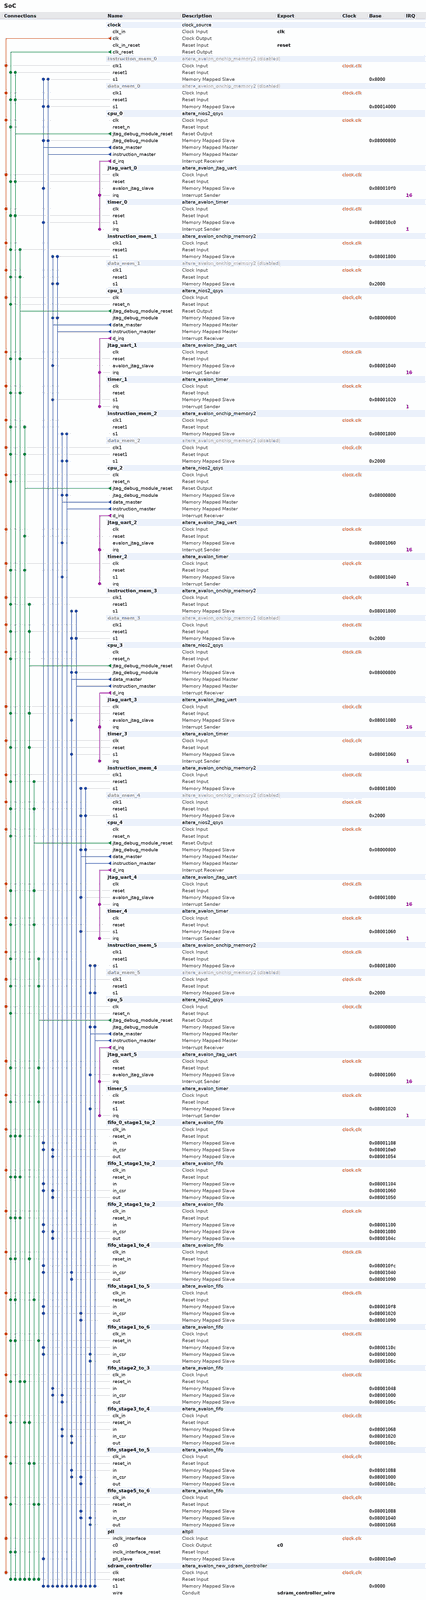
[diagram p0: system contents, whole]
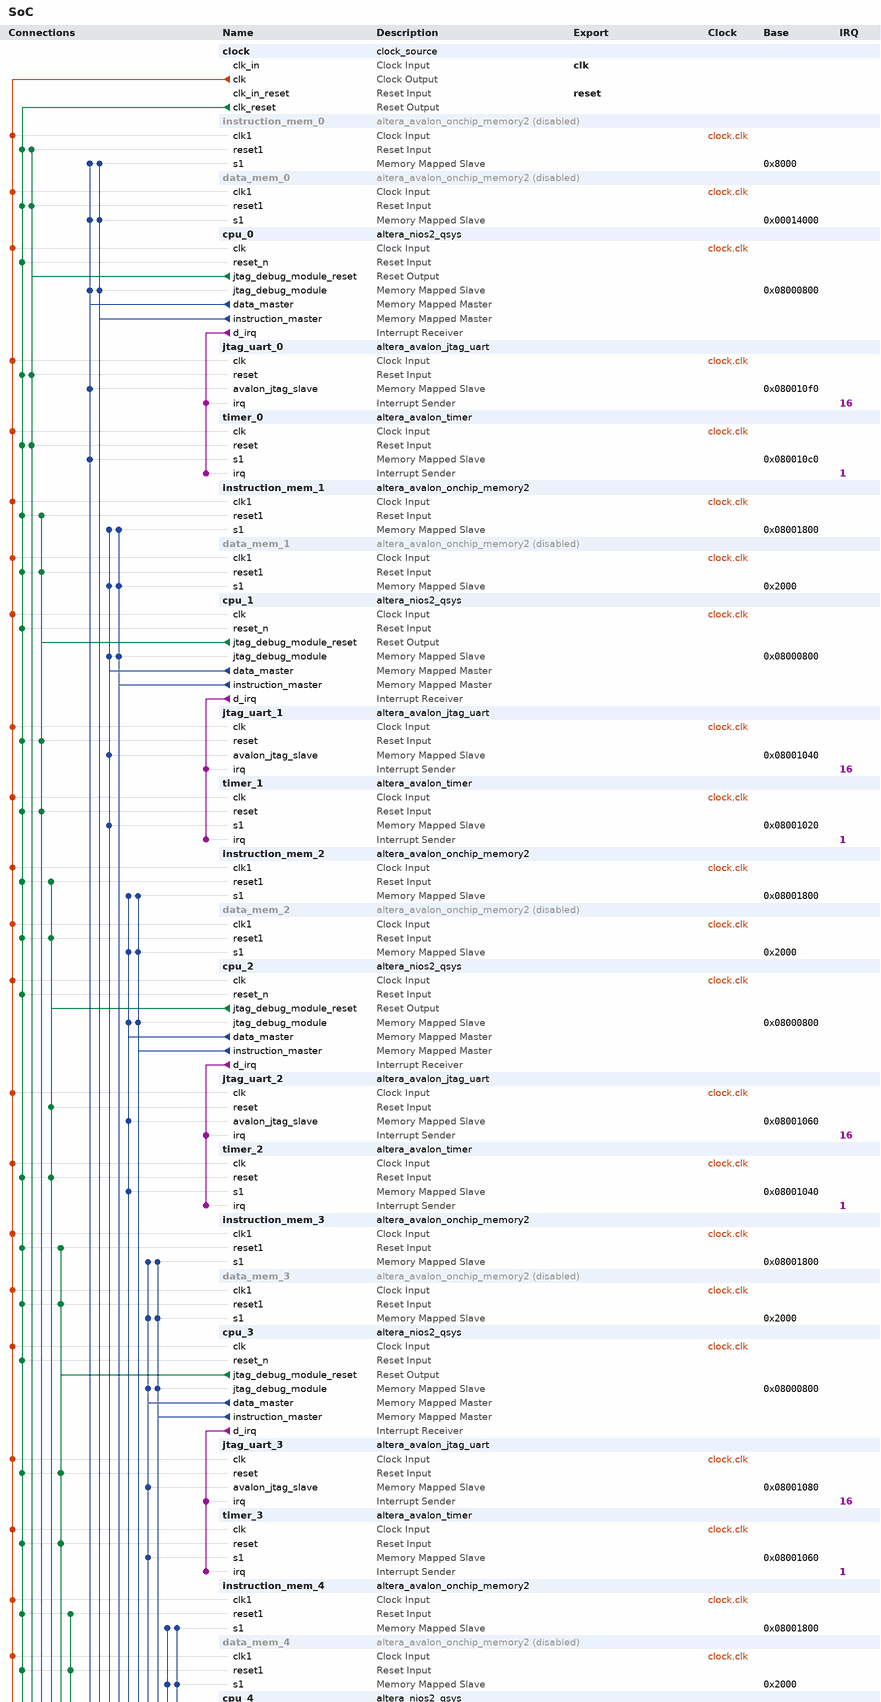
[diagram p1: system contents, upper part]
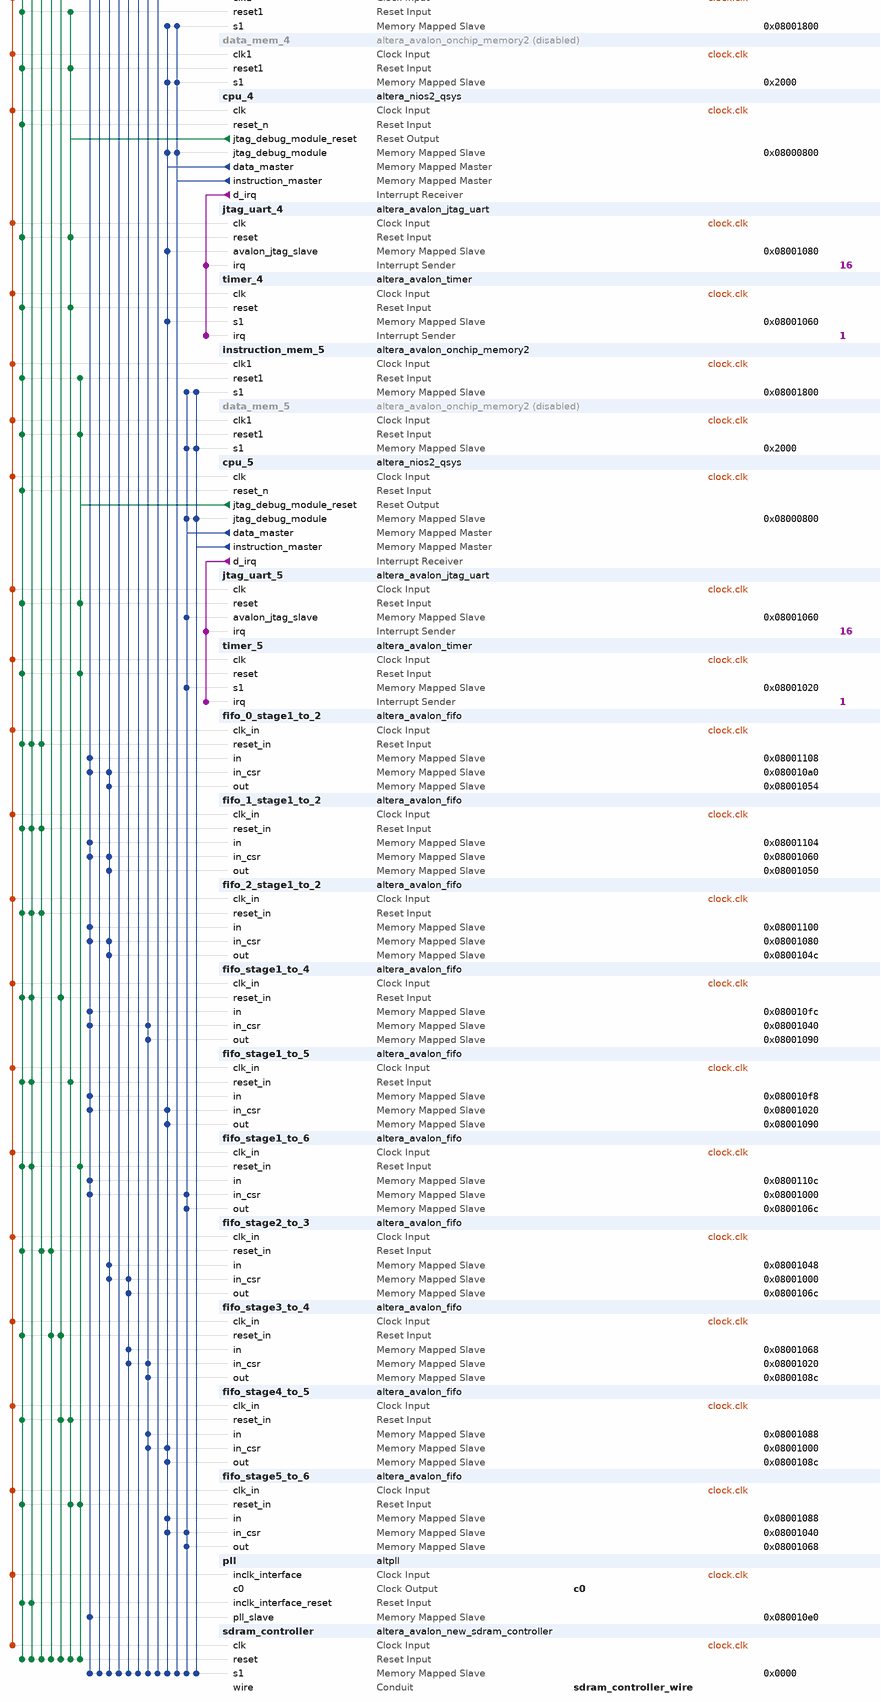
[diagram p2: system contents, lower part]
# Platform Designer (Qsys) system SoC, Cyclone IV E EP4CE115F29C7
# Parameters at their usual value, and those the tool derives, are not listed.
package require -exact qsys 12.1
create_system SoC
set_project_property DEVICE_FAMILY {Cyclone IV E}
set_project_property DEVICE EP4CE115F29C7

add_instance clock clock_source 12.1
set_instance_parameter_value clock clockFrequency 50000000

add_instance instruction_mem_0 altera_avalon_onchip_memory2 12.1
set_instance_property instruction_mem_0 ENABLED false
set_instance_parameter_value instruction_mem_0 dataWidth 32
set_instance_parameter_value instruction_mem_0 dualPort false
set_instance_parameter_value instruction_mem_0 initMemContent true
set_instance_parameter_value instruction_mem_0 initializationFileName instruction_mem_0
set_instance_parameter_value instruction_mem_0 memorySize 20480

add_instance data_mem_0 altera_avalon_onchip_memory2 12.1
set_instance_property data_mem_0 ENABLED false
set_instance_parameter_value data_mem_0 dataWidth 32
set_instance_parameter_value data_mem_0 dualPort false
set_instance_parameter_value data_mem_0 initMemContent true
set_instance_parameter_value data_mem_0 initializationFileName data_mem_0
set_instance_parameter_value data_mem_0 memorySize 12288

add_instance cpu_0 altera_nios2_qsys 12.1
set_instance_parameter_value cpu_0 resetSlave sdram_controller.s1
set_instance_parameter_value cpu_0 exceptionSlave sdram_controller.s1
set_instance_parameter_value cpu_0 breakSlave cpu_0.jtag_debug_module
set_instance_parameter_value cpu_0 impl Small
set_instance_parameter_value cpu_0 icache_size 4096

add_instance jtag_uart_0 altera_avalon_jtag_uart 12.1
set_instance_parameter_value jtag_uart_0 simInteractiveOptions INTERACTIVE_ASCII_OUTPUT

add_instance timer_0 altera_avalon_timer 12.1
set_instance_parameter_value timer_0 period 1
set_instance_parameter_value timer_0 periodUnits MSEC
set_instance_parameter_value timer_0 timerPreset CUSTOM

add_instance instruction_mem_1 altera_avalon_onchip_memory2 12.1
set_instance_parameter_value instruction_mem_1 dataWidth 32
set_instance_parameter_value instruction_mem_1 dualPort false
set_instance_parameter_value instruction_mem_1 initMemContent true
set_instance_parameter_value instruction_mem_1 initializationFileName instruction_mem_1
set_instance_parameter_value instruction_mem_1 memorySize 1024

add_instance data_mem_1 altera_avalon_onchip_memory2 12.1
set_instance_property data_mem_1 ENABLED false
set_instance_parameter_value data_mem_1 dataWidth 32
set_instance_parameter_value data_mem_1 dualPort false
set_instance_parameter_value data_mem_1 initMemContent true
set_instance_parameter_value data_mem_1 initializationFileName data_mem_1
set_instance_parameter_value data_mem_1 memorySize 8192

add_instance cpu_1 altera_nios2_qsys 12.1
set_instance_parameter_value cpu_1 resetSlave instruction_mem_1.s1
set_instance_parameter_value cpu_1 exceptionSlave instruction_mem_1.s1
set_instance_parameter_value cpu_1 breakSlave cpu_1.jtag_debug_module
set_instance_parameter_value cpu_1 impl Small
set_instance_parameter_value cpu_1 icache_size 4096

add_instance jtag_uart_1 altera_avalon_jtag_uart 12.1
set_instance_parameter_value jtag_uart_1 simInteractiveOptions INTERACTIVE_ASCII_OUTPUT

add_instance timer_1 altera_avalon_timer 12.1
set_instance_parameter_value timer_1 period 1
set_instance_parameter_value timer_1 periodUnits MSEC
set_instance_parameter_value timer_1 timerPreset CUSTOM

add_instance instruction_mem_2 altera_avalon_onchip_memory2 12.1
set_instance_parameter_value instruction_mem_2 dataWidth 32
set_instance_parameter_value instruction_mem_2 dualPort false
set_instance_parameter_value instruction_mem_2 initMemContent true
set_instance_parameter_value instruction_mem_2 initializationFileName instruction_mem_2
set_instance_parameter_value instruction_mem_2 memorySize 1024

add_instance data_mem_2 altera_avalon_onchip_memory2 12.1
set_instance_property data_mem_2 ENABLED false
set_instance_parameter_value data_mem_2 dataWidth 32
set_instance_parameter_value data_mem_2 dualPort false
set_instance_parameter_value data_mem_2 initMemContent true
set_instance_parameter_value data_mem_2 initializationFileName data_mem_2
set_instance_parameter_value data_mem_2 memorySize 4096

add_instance cpu_2 altera_nios2_qsys 12.1
set_instance_parameter_value cpu_2 resetSlave instruction_mem_2.s1
set_instance_parameter_value cpu_2 exceptionSlave instruction_mem_2.s1
set_instance_parameter_value cpu_2 breakSlave cpu_2.jtag_debug_module
set_instance_parameter_value cpu_2 impl Small
set_instance_parameter_value cpu_2 icache_size 4096

add_instance jtag_uart_2 altera_avalon_jtag_uart 12.1
set_instance_parameter_value jtag_uart_2 simInteractiveOptions INTERACTIVE_ASCII_OUTPUT

add_instance timer_2 altera_avalon_timer 12.1
set_instance_parameter_value timer_2 period 1
set_instance_parameter_value timer_2 periodUnits MSEC
set_instance_parameter_value timer_2 timerPreset CUSTOM

add_instance instruction_mem_3 altera_avalon_onchip_memory2 12.1
set_instance_parameter_value instruction_mem_3 dataWidth 32
set_instance_parameter_value instruction_mem_3 dualPort false
set_instance_parameter_value instruction_mem_3 initMemContent true
set_instance_parameter_value instruction_mem_3 initializationFileName instruction_mem_3
set_instance_parameter_value instruction_mem_3 memorySize 1024

add_instance data_mem_3 altera_avalon_onchip_memory2 12.1
set_instance_property data_mem_3 ENABLED false
set_instance_parameter_value data_mem_3 dataWidth 32
set_instance_parameter_value data_mem_3 dualPort false
set_instance_parameter_value data_mem_3 initMemContent true
set_instance_parameter_value data_mem_3 initializationFileName data_mem_3
set_instance_parameter_value data_mem_3 memorySize 4096

add_instance cpu_3 altera_nios2_qsys 12.1
set_instance_parameter_value cpu_3 resetSlave instruction_mem_3.s1
set_instance_parameter_value cpu_3 exceptionSlave instruction_mem_3.s1
set_instance_parameter_value cpu_3 breakSlave cpu_3.jtag_debug_module
set_instance_parameter_value cpu_3 impl Small
set_instance_parameter_value cpu_3 icache_size 4096

add_instance jtag_uart_3 altera_avalon_jtag_uart 12.1
set_instance_parameter_value jtag_uart_3 simInteractiveOptions INTERACTIVE_ASCII_OUTPUT

add_instance timer_3 altera_avalon_timer 12.1
set_instance_parameter_value timer_3 period 1
set_instance_parameter_value timer_3 periodUnits MSEC
set_instance_parameter_value timer_3 timerPreset CUSTOM

add_instance instruction_mem_4 altera_avalon_onchip_memory2 12.1
set_instance_parameter_value instruction_mem_4 dataWidth 32
set_instance_parameter_value instruction_mem_4 dualPort false
set_instance_parameter_value instruction_mem_4 initMemContent true
set_instance_parameter_value instruction_mem_4 initializationFileName instruction_mem_4
set_instance_parameter_value instruction_mem_4 memorySize 1024

add_instance data_mem_4 altera_avalon_onchip_memory2 12.1
set_instance_property data_mem_4 ENABLED false
set_instance_parameter_value data_mem_4 dataWidth 32
set_instance_parameter_value data_mem_4 dualPort false
set_instance_parameter_value data_mem_4 initMemContent true
set_instance_parameter_value data_mem_4 initializationFileName data_mem_4
set_instance_parameter_value data_mem_4 memorySize 4096

add_instance cpu_4 altera_nios2_qsys 12.1
set_instance_parameter_value cpu_4 resetSlave instruction_mem_4.s1
set_instance_parameter_value cpu_4 exceptionSlave instruction_mem_4.s1
set_instance_parameter_value cpu_4 breakSlave cpu_4.jtag_debug_module
set_instance_parameter_value cpu_4 impl Small
set_instance_parameter_value cpu_4 icache_size 4096

add_instance jtag_uart_4 altera_avalon_jtag_uart 12.1
set_instance_parameter_value jtag_uart_4 simInteractiveOptions INTERACTIVE_ASCII_OUTPUT

add_instance timer_4 altera_avalon_timer 12.1
set_instance_parameter_value timer_4 period 1
set_instance_parameter_value timer_4 periodUnits MSEC
set_instance_parameter_value timer_4 timerPreset CUSTOM

add_instance instruction_mem_5 altera_avalon_onchip_memory2 12.1
set_instance_parameter_value instruction_mem_5 dataWidth 32
set_instance_parameter_value instruction_mem_5 dualPort false
set_instance_parameter_value instruction_mem_5 initMemContent true
set_instance_parameter_value instruction_mem_5 initializationFileName instruction_mem_5
set_instance_parameter_value instruction_mem_5 memorySize 1024

add_instance data_mem_5 altera_avalon_onchip_memory2 12.1
set_instance_property data_mem_5 ENABLED false
set_instance_parameter_value data_mem_5 dataWidth 32
set_instance_parameter_value data_mem_5 dualPort false
set_instance_parameter_value data_mem_5 initMemContent true
set_instance_parameter_value data_mem_5 initializationFileName data_mem_5
set_instance_parameter_value data_mem_5 memorySize 4096

add_instance cpu_5 altera_nios2_qsys 12.1
set_instance_parameter_value cpu_5 resetSlave instruction_mem_5.s1
set_instance_parameter_value cpu_5 exceptionSlave instruction_mem_5.s1
set_instance_parameter_value cpu_5 breakSlave cpu_5.jtag_debug_module
set_instance_parameter_value cpu_5 impl Small
set_instance_parameter_value cpu_5 icache_size 4096

add_instance jtag_uart_5 altera_avalon_jtag_uart 12.1
set_instance_parameter_value jtag_uart_5 simInteractiveOptions INTERACTIVE_ASCII_OUTPUT

add_instance timer_5 altera_avalon_timer 12.1
set_instance_parameter_value timer_5 period 1
set_instance_parameter_value timer_5 periodUnits MSEC
set_instance_parameter_value timer_5 timerPreset CUSTOM

add_instance fifo_0_stage1_to_2 altera_avalon_fifo 12.1
set_instance_parameter_value fifo_0_stage1_to_2 bitsPerSymbol 16
set_instance_parameter_value fifo_0_stage1_to_2 channelWidth 8
set_instance_parameter_value fifo_0_stage1_to_2 errorWidth 8
set_instance_parameter_value fifo_0_stage1_to_2 fifoDepth 64
set_instance_parameter_value fifo_0_stage1_to_2 fifoInputInterfaceOptions AVALONMM_WRITE
set_instance_parameter_value fifo_0_stage1_to_2 fifoOutputInterfaceOptions AVALONMM_READ
set_instance_parameter_value fifo_0_stage1_to_2 singleClockMode true
set_instance_parameter_value fifo_0_stage1_to_2 symbolsPerBeat 2
set_instance_parameter_value fifo_0_stage1_to_2 useIRQ true
set_instance_parameter_value fifo_0_stage1_to_2 usePacket true
set_instance_parameter_value fifo_0_stage1_to_2 useReadControl false

add_instance fifo_1_stage1_to_2 altera_avalon_fifo 12.1
set_instance_parameter_value fifo_1_stage1_to_2 bitsPerSymbol 16
set_instance_parameter_value fifo_1_stage1_to_2 channelWidth 8
set_instance_parameter_value fifo_1_stage1_to_2 errorWidth 8
set_instance_parameter_value fifo_1_stage1_to_2 fifoDepth 64
set_instance_parameter_value fifo_1_stage1_to_2 fifoInputInterfaceOptions AVALONMM_WRITE
set_instance_parameter_value fifo_1_stage1_to_2 fifoOutputInterfaceOptions AVALONMM_READ
set_instance_parameter_value fifo_1_stage1_to_2 singleClockMode true
set_instance_parameter_value fifo_1_stage1_to_2 symbolsPerBeat 2
set_instance_parameter_value fifo_1_stage1_to_2 useIRQ true
set_instance_parameter_value fifo_1_stage1_to_2 usePacket true
set_instance_parameter_value fifo_1_stage1_to_2 useReadControl false

add_instance fifo_2_stage1_to_2 altera_avalon_fifo 12.1
set_instance_parameter_value fifo_2_stage1_to_2 bitsPerSymbol 16
set_instance_parameter_value fifo_2_stage1_to_2 channelWidth 8
set_instance_parameter_value fifo_2_stage1_to_2 errorWidth 8
set_instance_parameter_value fifo_2_stage1_to_2 fifoDepth 64
set_instance_parameter_value fifo_2_stage1_to_2 fifoInputInterfaceOptions AVALONMM_WRITE
set_instance_parameter_value fifo_2_stage1_to_2 fifoOutputInterfaceOptions AVALONMM_READ
set_instance_parameter_value fifo_2_stage1_to_2 singleClockMode true
set_instance_parameter_value fifo_2_stage1_to_2 symbolsPerBeat 2
set_instance_parameter_value fifo_2_stage1_to_2 useIRQ true
set_instance_parameter_value fifo_2_stage1_to_2 usePacket true
set_instance_parameter_value fifo_2_stage1_to_2 useReadControl false

add_instance fifo_stage1_to_4 altera_avalon_fifo 12.1
set_instance_parameter_value fifo_stage1_to_4 bitsPerSymbol 16
set_instance_parameter_value fifo_stage1_to_4 channelWidth 8
set_instance_parameter_value fifo_stage1_to_4 errorWidth 8
set_instance_parameter_value fifo_stage1_to_4 fifoDepth 8
set_instance_parameter_value fifo_stage1_to_4 fifoInputInterfaceOptions AVALONMM_WRITE
set_instance_parameter_value fifo_stage1_to_4 fifoOutputInterfaceOptions AVALONMM_READ
set_instance_parameter_value fifo_stage1_to_4 singleClockMode true
set_instance_parameter_value fifo_stage1_to_4 symbolsPerBeat 2
set_instance_parameter_value fifo_stage1_to_4 useIRQ true
set_instance_parameter_value fifo_stage1_to_4 usePacket true
set_instance_parameter_value fifo_stage1_to_4 useReadControl false

add_instance fifo_stage1_to_5 altera_avalon_fifo 12.1
set_instance_parameter_value fifo_stage1_to_5 bitsPerSymbol 16
set_instance_parameter_value fifo_stage1_to_5 channelWidth 8
set_instance_parameter_value fifo_stage1_to_5 errorWidth 8
set_instance_parameter_value fifo_stage1_to_5 fifoDepth 8
set_instance_parameter_value fifo_stage1_to_5 fifoInputInterfaceOptions AVALONMM_WRITE
set_instance_parameter_value fifo_stage1_to_5 fifoOutputInterfaceOptions AVALONMM_READ
set_instance_parameter_value fifo_stage1_to_5 singleClockMode true
set_instance_parameter_value fifo_stage1_to_5 symbolsPerBeat 2
set_instance_parameter_value fifo_stage1_to_5 useIRQ true
set_instance_parameter_value fifo_stage1_to_5 usePacket true
set_instance_parameter_value fifo_stage1_to_5 useReadControl false

add_instance fifo_stage1_to_6 altera_avalon_fifo 12.1
set_instance_parameter_value fifo_stage1_to_6 avalonMMAvalonMMDataWidth 8
set_instance_parameter_value fifo_stage1_to_6 bitsPerSymbol 16
set_instance_parameter_value fifo_stage1_to_6 channelWidth 8
set_instance_parameter_value fifo_stage1_to_6 errorWidth 8
set_instance_parameter_value fifo_stage1_to_6 fifoDepth 256
set_instance_parameter_value fifo_stage1_to_6 fifoInputInterfaceOptions AVALONMM_WRITE
set_instance_parameter_value fifo_stage1_to_6 fifoOutputInterfaceOptions AVALONMM_READ
set_instance_parameter_value fifo_stage1_to_6 singleClockMode true
set_instance_parameter_value fifo_stage1_to_6 symbolsPerBeat 2
set_instance_parameter_value fifo_stage1_to_6 useIRQ true
set_instance_parameter_value fifo_stage1_to_6 usePacket true
set_instance_parameter_value fifo_stage1_to_6 useReadControl false

add_instance fifo_stage2_to_3 altera_avalon_fifo 12.1
set_instance_parameter_value fifo_stage2_to_3 bitsPerSymbol 16
set_instance_parameter_value fifo_stage2_to_3 channelWidth 8
set_instance_parameter_value fifo_stage2_to_3 errorWidth 8
set_instance_parameter_value fifo_stage2_to_3 fifoDepth 256
set_instance_parameter_value fifo_stage2_to_3 fifoInputInterfaceOptions AVALONMM_WRITE
set_instance_parameter_value fifo_stage2_to_3 fifoOutputInterfaceOptions AVALONMM_READ
set_instance_parameter_value fifo_stage2_to_3 singleClockMode true
set_instance_parameter_value fifo_stage2_to_3 symbolsPerBeat 2
set_instance_parameter_value fifo_stage2_to_3 useIRQ true
set_instance_parameter_value fifo_stage2_to_3 usePacket true
set_instance_parameter_value fifo_stage2_to_3 useReadControl false

add_instance fifo_stage3_to_4 altera_avalon_fifo 12.1
set_instance_parameter_value fifo_stage3_to_4 bitsPerSymbol 16
set_instance_parameter_value fifo_stage3_to_4 channelWidth 8
set_instance_parameter_value fifo_stage3_to_4 errorWidth 8
set_instance_parameter_value fifo_stage3_to_4 fifoDepth 256
set_instance_parameter_value fifo_stage3_to_4 fifoInputInterfaceOptions AVALONMM_WRITE
set_instance_parameter_value fifo_stage3_to_4 fifoOutputInterfaceOptions AVALONMM_READ
set_instance_parameter_value fifo_stage3_to_4 singleClockMode true
set_instance_parameter_value fifo_stage3_to_4 symbolsPerBeat 2
set_instance_parameter_value fifo_stage3_to_4 useIRQ true
set_instance_parameter_value fifo_stage3_to_4 usePacket true
set_instance_parameter_value fifo_stage3_to_4 useReadControl false

add_instance fifo_stage4_to_5 altera_avalon_fifo 12.1
set_instance_parameter_value fifo_stage4_to_5 bitsPerSymbol 16
set_instance_parameter_value fifo_stage4_to_5 channelWidth 8
set_instance_parameter_value fifo_stage4_to_5 errorWidth 8
set_instance_parameter_value fifo_stage4_to_5 fifoDepth 256
set_instance_parameter_value fifo_stage4_to_5 fifoInputInterfaceOptions AVALONMM_WRITE
set_instance_parameter_value fifo_stage4_to_5 fifoOutputInterfaceOptions AVALONMM_READ
set_instance_parameter_value fifo_stage4_to_5 singleClockMode true
set_instance_parameter_value fifo_stage4_to_5 symbolsPerBeat 2
set_instance_parameter_value fifo_stage4_to_5 useIRQ true
set_instance_parameter_value fifo_stage4_to_5 usePacket true
set_instance_parameter_value fifo_stage4_to_5 useReadControl false

add_instance fifo_stage5_to_6 altera_avalon_fifo 12.1
set_instance_parameter_value fifo_stage5_to_6 bitsPerSymbol 16
set_instance_parameter_value fifo_stage5_to_6 channelWidth 8
set_instance_parameter_value fifo_stage5_to_6 errorWidth 8
set_instance_parameter_value fifo_stage5_to_6 fifoDepth 256
set_instance_parameter_value fifo_stage5_to_6 fifoInputInterfaceOptions AVALONMM_WRITE
set_instance_parameter_value fifo_stage5_to_6 fifoOutputInterfaceOptions AVALONMM_READ
set_instance_parameter_value fifo_stage5_to_6 singleClockMode true
set_instance_parameter_value fifo_stage5_to_6 symbolsPerBeat 2
set_instance_parameter_value fifo_stage5_to_6 useIRQ true
set_instance_parameter_value fifo_stage5_to_6 usePacket true
set_instance_parameter_value fifo_stage5_to_6 useReadControl false

add_instance pll altpll 12.1
set_instance_parameter_value pll INCLK0_INPUT_FREQUENCY 20000
set_instance_parameter_value pll CLK0_MULTIPLY_BY 1
set_instance_parameter_value pll CLK0_DIVIDE_BY 1
set_instance_parameter_value pll CLK0_PHASE_SHIFT -3611
set_instance_parameter_value pll PORT_clk1 PORT_UNUSED
set_instance_parameter_value pll PORT_clk2 PORT_UNUSED
set_instance_parameter_value pll PORT_clk3 PORT_UNUSED
set_instance_parameter_value pll PORT_ARESET PORT_USED
set_instance_parameter_value pll PORT_LOCKED PORT_USED

add_instance sdram_controller altera_avalon_new_sdram_controller 12.1
set_instance_parameter_value sdram_controller TAC 6.0
set_instance_parameter_value sdram_controller TRCD 20.0
set_instance_parameter_value sdram_controller TRP 20.0
set_instance_parameter_value sdram_controller casLatency 3
set_instance_parameter_value sdram_controller columnWidth 10
set_instance_parameter_value sdram_controller dataWidth 32
set_instance_parameter_value sdram_controller generateSimulationModel false
set_instance_parameter_value sdram_controller model custom
set_instance_parameter_value sdram_controller numberOfBanks 4
set_instance_parameter_value sdram_controller numberOfChipSelects 1
set_instance_parameter_value sdram_controller powerUpDelay 100.0
set_instance_parameter_value sdram_controller refreshPeriod 15.625
set_instance_parameter_value sdram_controller rowWidth 13

# connections
add_connection clock.clk cpu_0.clk clock
add_connection clock.clk cpu_1.clk clock
add_connection clock.clk cpu_2.clk clock
add_connection clock.clk cpu_3.clk clock
add_connection clock.clk cpu_4.clk clock
add_connection clock.clk cpu_5.clk clock
add_connection clock.clk data_mem_0.clk1 clock
add_connection clock.clk data_mem_1.clk1 clock
add_connection clock.clk data_mem_2.clk1 clock
add_connection clock.clk data_mem_3.clk1 clock
add_connection clock.clk data_mem_4.clk1 clock
add_connection clock.clk data_mem_5.clk1 clock
add_connection clock.clk fifo_0_stage1_to_2.clk_in clock
add_connection clock.clk fifo_1_stage1_to_2.clk_in clock
add_connection clock.clk fifo_2_stage1_to_2.clk_in clock
add_connection clock.clk fifo_stage1_to_4.clk_in clock
add_connection clock.clk fifo_stage1_to_5.clk_in clock
add_connection clock.clk fifo_stage1_to_6.clk_in clock
add_connection clock.clk fifo_stage2_to_3.clk_in clock
add_connection clock.clk fifo_stage3_to_4.clk_in clock
add_connection clock.clk fifo_stage4_to_5.clk_in clock
add_connection clock.clk fifo_stage5_to_6.clk_in clock
add_connection clock.clk instruction_mem_0.clk1 clock
add_connection clock.clk instruction_mem_1.clk1 clock
add_connection clock.clk instruction_mem_2.clk1 clock
add_connection clock.clk instruction_mem_3.clk1 clock
add_connection clock.clk instruction_mem_4.clk1 clock
add_connection clock.clk instruction_mem_5.clk1 clock
add_connection clock.clk jtag_uart_0.clk clock
add_connection clock.clk jtag_uart_1.clk clock
add_connection clock.clk jtag_uart_2.clk clock
add_connection clock.clk jtag_uart_3.clk clock
add_connection clock.clk jtag_uart_4.clk clock
add_connection clock.clk jtag_uart_5.clk clock
add_connection clock.clk pll.inclk_interface clock
add_connection clock.clk sdram_controller.clk clock
add_connection clock.clk timer_0.clk clock
add_connection clock.clk timer_1.clk clock
add_connection clock.clk timer_2.clk clock
add_connection clock.clk timer_3.clk clock
add_connection clock.clk timer_4.clk clock
add_connection clock.clk timer_5.clk clock
add_connection clock.clk_reset cpu_0.reset_n reset
add_connection clock.clk_reset cpu_1.reset_n reset
add_connection clock.clk_reset cpu_2.reset_n reset
add_connection clock.clk_reset cpu_3.reset_n reset
add_connection clock.clk_reset cpu_4.reset_n reset
add_connection clock.clk_reset cpu_5.reset_n reset
add_connection clock.clk_reset data_mem_0.reset1 reset
add_connection clock.clk_reset data_mem_1.reset1 reset
add_connection clock.clk_reset data_mem_2.reset1 reset
add_connection clock.clk_reset data_mem_3.reset1 reset
add_connection clock.clk_reset data_mem_4.reset1 reset
add_connection clock.clk_reset data_mem_5.reset1 reset
add_connection clock.clk_reset fifo_0_stage1_to_2.reset_in reset
add_connection clock.clk_reset fifo_1_stage1_to_2.reset_in reset
add_connection clock.clk_reset fifo_2_stage1_to_2.reset_in reset
add_connection clock.clk_reset fifo_stage1_to_4.reset_in reset
add_connection clock.clk_reset fifo_stage1_to_5.reset_in reset
add_connection clock.clk_reset fifo_stage1_to_6.reset_in reset
add_connection clock.clk_reset fifo_stage2_to_3.reset_in reset
add_connection clock.clk_reset fifo_stage3_to_4.reset_in reset
add_connection clock.clk_reset fifo_stage4_to_5.reset_in reset
add_connection clock.clk_reset fifo_stage5_to_6.reset_in reset
add_connection clock.clk_reset instruction_mem_0.reset1 reset
add_connection clock.clk_reset instruction_mem_1.reset1 reset
add_connection clock.clk_reset instruction_mem_2.reset1 reset
add_connection clock.clk_reset instruction_mem_3.reset1 reset
add_connection clock.clk_reset instruction_mem_4.reset1 reset
add_connection clock.clk_reset instruction_mem_5.reset1 reset
add_connection clock.clk_reset jtag_uart_0.reset reset
add_connection clock.clk_reset jtag_uart_1.reset reset
add_connection clock.clk_reset jtag_uart_3.reset reset
add_connection clock.clk_reset jtag_uart_4.reset reset
add_connection clock.clk_reset jtag_uart_5.reset reset
add_connection clock.clk_reset pll.inclk_interface_reset reset
add_connection clock.clk_reset sdram_controller.reset reset
add_connection clock.clk_reset timer_0.reset reset
add_connection clock.clk_reset timer_1.reset reset
add_connection clock.clk_reset timer_2.reset reset
add_connection clock.clk_reset timer_3.reset reset
add_connection clock.clk_reset timer_4.reset reset
add_connection clock.clk_reset timer_5.reset reset
add_connection cpu_0.jtag_debug_module_reset data_mem_0.reset1 reset
add_connection cpu_0.jtag_debug_module_reset fifo_0_stage1_to_2.reset_in reset
add_connection cpu_0.jtag_debug_module_reset fifo_1_stage1_to_2.reset_in reset
add_connection cpu_0.jtag_debug_module_reset fifo_2_stage1_to_2.reset_in reset
add_connection cpu_0.jtag_debug_module_reset fifo_stage1_to_4.reset_in reset
add_connection cpu_0.jtag_debug_module_reset fifo_stage1_to_5.reset_in reset
add_connection cpu_0.jtag_debug_module_reset fifo_stage1_to_6.reset_in reset
add_connection cpu_0.jtag_debug_module_reset instruction_mem_0.reset1 reset
add_connection cpu_0.jtag_debug_module_reset jtag_uart_0.reset reset
add_connection cpu_0.jtag_debug_module_reset pll.inclk_interface_reset reset
add_connection cpu_0.jtag_debug_module_reset sdram_controller.reset reset
add_connection cpu_0.jtag_debug_module_reset timer_0.reset reset
add_connection cpu_1.jtag_debug_module_reset data_mem_1.reset1 reset
add_connection cpu_1.jtag_debug_module_reset fifo_0_stage1_to_2.reset_in reset
add_connection cpu_1.jtag_debug_module_reset fifo_1_stage1_to_2.reset_in reset
add_connection cpu_1.jtag_debug_module_reset fifo_2_stage1_to_2.reset_in reset
add_connection cpu_1.jtag_debug_module_reset fifo_stage2_to_3.reset_in reset
add_connection cpu_1.jtag_debug_module_reset instruction_mem_1.reset1 reset
add_connection cpu_1.jtag_debug_module_reset jtag_uart_1.reset reset
add_connection cpu_1.jtag_debug_module_reset sdram_controller.reset reset
add_connection cpu_1.jtag_debug_module_reset timer_1.reset reset
add_connection cpu_2.jtag_debug_module_reset data_mem_2.reset1 reset
add_connection cpu_2.jtag_debug_module_reset fifo_stage2_to_3.reset_in reset
add_connection cpu_2.jtag_debug_module_reset fifo_stage3_to_4.reset_in reset
add_connection cpu_2.jtag_debug_module_reset instruction_mem_2.reset1 reset
add_connection cpu_2.jtag_debug_module_reset jtag_uart_2.reset reset
add_connection cpu_2.jtag_debug_module_reset sdram_controller.reset reset
add_connection cpu_2.jtag_debug_module_reset timer_2.reset reset
add_connection cpu_3.jtag_debug_module_reset data_mem_3.reset1 reset
add_connection cpu_3.jtag_debug_module_reset fifo_stage1_to_4.reset_in reset
add_connection cpu_3.jtag_debug_module_reset fifo_stage3_to_4.reset_in reset
add_connection cpu_3.jtag_debug_module_reset fifo_stage4_to_5.reset_in reset
add_connection cpu_3.jtag_debug_module_reset instruction_mem_3.reset1 reset
add_connection cpu_3.jtag_debug_module_reset jtag_uart_3.reset reset
add_connection cpu_3.jtag_debug_module_reset sdram_controller.reset reset
add_connection cpu_3.jtag_debug_module_reset timer_3.reset reset
add_connection cpu_4.jtag_debug_module_reset data_mem_4.reset1 reset
add_connection cpu_4.jtag_debug_module_reset fifo_stage1_to_5.reset_in reset
add_connection cpu_4.jtag_debug_module_reset fifo_stage4_to_5.reset_in reset
add_connection cpu_4.jtag_debug_module_reset fifo_stage5_to_6.reset_in reset
add_connection cpu_4.jtag_debug_module_reset instruction_mem_4.reset1 reset
add_connection cpu_4.jtag_debug_module_reset jtag_uart_4.reset reset
add_connection cpu_4.jtag_debug_module_reset sdram_controller.reset reset
add_connection cpu_4.jtag_debug_module_reset timer_4.reset reset
add_connection cpu_5.jtag_debug_module_reset data_mem_5.reset1 reset
add_connection cpu_5.jtag_debug_module_reset fifo_stage1_to_6.reset_in reset
add_connection cpu_5.jtag_debug_module_reset fifo_stage5_to_6.reset_in reset
add_connection cpu_5.jtag_debug_module_reset instruction_mem_5.reset1 reset
add_connection cpu_5.jtag_debug_module_reset jtag_uart_5.reset reset
add_connection cpu_5.jtag_debug_module_reset sdram_controller.reset reset
add_connection cpu_5.jtag_debug_module_reset timer_5.reset reset
add_connection cpu_0.data_master cpu_0.jtag_debug_module avalon
set_connection_parameter_value cpu_0.data_master/cpu_0.jtag_debug_module baseAddress 0x08000800
add_connection cpu_0.data_master data_mem_0.s1 avalon
set_connection_parameter_value cpu_0.data_master/data_mem_0.s1 baseAddress 0x00014000
add_connection cpu_0.data_master fifo_0_stage1_to_2.in avalon
set_connection_parameter_value cpu_0.data_master/fifo_0_stage1_to_2.in baseAddress 0x08001108
add_connection cpu_0.data_master fifo_0_stage1_to_2.in_csr avalon
set_connection_parameter_value cpu_0.data_master/fifo_0_stage1_to_2.in_csr baseAddress 0x080010a0
add_connection cpu_0.data_master fifo_1_stage1_to_2.in avalon
set_connection_parameter_value cpu_0.data_master/fifo_1_stage1_to_2.in baseAddress 0x08001104
add_connection cpu_0.data_master fifo_1_stage1_to_2.in_csr avalon
set_connection_parameter_value cpu_0.data_master/fifo_1_stage1_to_2.in_csr baseAddress 0x08001060
add_connection cpu_0.data_master fifo_2_stage1_to_2.in avalon
set_connection_parameter_value cpu_0.data_master/fifo_2_stage1_to_2.in baseAddress 0x08001100
add_connection cpu_0.data_master fifo_2_stage1_to_2.in_csr avalon
set_connection_parameter_value cpu_0.data_master/fifo_2_stage1_to_2.in_csr baseAddress 0x08001080
add_connection cpu_0.data_master fifo_stage1_to_4.in avalon
set_connection_parameter_value cpu_0.data_master/fifo_stage1_to_4.in baseAddress 0x080010fc
add_connection cpu_0.data_master fifo_stage1_to_4.in_csr avalon
set_connection_parameter_value cpu_0.data_master/fifo_stage1_to_4.in_csr baseAddress 0x08001040
add_connection cpu_0.data_master fifo_stage1_to_5.in avalon
set_connection_parameter_value cpu_0.data_master/fifo_stage1_to_5.in baseAddress 0x080010f8
add_connection cpu_0.data_master fifo_stage1_to_5.in_csr avalon
set_connection_parameter_value cpu_0.data_master/fifo_stage1_to_5.in_csr baseAddress 0x08001020
add_connection cpu_0.data_master fifo_stage1_to_6.in avalon
set_connection_parameter_value cpu_0.data_master/fifo_stage1_to_6.in baseAddress 0x0800110c
add_connection cpu_0.data_master fifo_stage1_to_6.in_csr avalon
set_connection_parameter_value cpu_0.data_master/fifo_stage1_to_6.in_csr baseAddress 0x08001000
add_connection cpu_0.data_master instruction_mem_0.s1 avalon
set_connection_parameter_value cpu_0.data_master/instruction_mem_0.s1 baseAddress 0x8000
add_connection cpu_0.data_master jtag_uart_0.avalon_jtag_slave avalon
set_connection_parameter_value cpu_0.data_master/jtag_uart_0.avalon_jtag_slave baseAddress 0x080010f0
add_connection cpu_0.data_master pll.pll_slave avalon
set_connection_parameter_value cpu_0.data_master/pll.pll_slave baseAddress 0x080010e0
add_connection cpu_0.data_master sdram_controller.s1 avalon
set_connection_parameter_value cpu_0.data_master/sdram_controller.s1 baseAddress 0x0000
add_connection cpu_0.data_master timer_0.s1 avalon
set_connection_parameter_value cpu_0.data_master/timer_0.s1 baseAddress 0x080010c0
add_connection cpu_0.instruction_master cpu_0.jtag_debug_module avalon
set_connection_parameter_value cpu_0.instruction_master/cpu_0.jtag_debug_module baseAddress 0x08000800
add_connection cpu_0.instruction_master data_mem_0.s1 avalon
set_connection_parameter_value cpu_0.instruction_master/data_mem_0.s1 baseAddress 0x00014000
add_connection cpu_0.instruction_master instruction_mem_0.s1 avalon
set_connection_parameter_value cpu_0.instruction_master/instruction_mem_0.s1 baseAddress 0x8000
add_connection cpu_0.instruction_master sdram_controller.s1 avalon
set_connection_parameter_value cpu_0.instruction_master/sdram_controller.s1 baseAddress 0x0000
add_connection cpu_1.data_master cpu_1.jtag_debug_module avalon
set_connection_parameter_value cpu_1.data_master/cpu_1.jtag_debug_module baseAddress 0x08000800
add_connection cpu_1.data_master data_mem_1.s1 avalon
set_connection_parameter_value cpu_1.data_master/data_mem_1.s1 baseAddress 0x2000
add_connection cpu_1.data_master fifo_0_stage1_to_2.in_csr avalon
set_connection_parameter_value cpu_1.data_master/fifo_0_stage1_to_2.in_csr baseAddress 0x080010a0
add_connection cpu_1.data_master fifo_0_stage1_to_2.out avalon
set_connection_parameter_value cpu_1.data_master/fifo_0_stage1_to_2.out baseAddress 0x08001054
add_connection cpu_1.data_master fifo_1_stage1_to_2.in_csr avalon
set_connection_parameter_value cpu_1.data_master/fifo_1_stage1_to_2.in_csr baseAddress 0x08001060
add_connection cpu_1.data_master fifo_1_stage1_to_2.out avalon
set_connection_parameter_value cpu_1.data_master/fifo_1_stage1_to_2.out baseAddress 0x08001050
add_connection cpu_1.data_master fifo_2_stage1_to_2.in_csr avalon
set_connection_parameter_value cpu_1.data_master/fifo_2_stage1_to_2.in_csr baseAddress 0x08001080
add_connection cpu_1.data_master fifo_2_stage1_to_2.out avalon
set_connection_parameter_value cpu_1.data_master/fifo_2_stage1_to_2.out baseAddress 0x0800104c
add_connection cpu_1.data_master fifo_stage2_to_3.in avalon
set_connection_parameter_value cpu_1.data_master/fifo_stage2_to_3.in baseAddress 0x08001048
add_connection cpu_1.data_master fifo_stage2_to_3.in_csr avalon
set_connection_parameter_value cpu_1.data_master/fifo_stage2_to_3.in_csr baseAddress 0x08001000
add_connection cpu_1.data_master instruction_mem_1.s1 avalon
set_connection_parameter_value cpu_1.data_master/instruction_mem_1.s1 baseAddress 0x08001800
add_connection cpu_1.data_master jtag_uart_1.avalon_jtag_slave avalon
set_connection_parameter_value cpu_1.data_master/jtag_uart_1.avalon_jtag_slave baseAddress 0x08001040
add_connection cpu_1.data_master sdram_controller.s1 avalon
set_connection_parameter_value cpu_1.data_master/sdram_controller.s1 baseAddress 0x0000
add_connection cpu_1.data_master timer_1.s1 avalon
set_connection_parameter_value cpu_1.data_master/timer_1.s1 baseAddress 0x08001020
add_connection cpu_1.instruction_master cpu_1.jtag_debug_module avalon
set_connection_parameter_value cpu_1.instruction_master/cpu_1.jtag_debug_module baseAddress 0x08000800
add_connection cpu_1.instruction_master data_mem_1.s1 avalon
set_connection_parameter_value cpu_1.instruction_master/data_mem_1.s1 baseAddress 0x2000
add_connection cpu_1.instruction_master instruction_mem_1.s1 avalon
set_connection_parameter_value cpu_1.instruction_master/instruction_mem_1.s1 baseAddress 0x08001800
add_connection cpu_1.instruction_master sdram_controller.s1 avalon
set_connection_parameter_value cpu_1.instruction_master/sdram_controller.s1 baseAddress 0x0000
add_connection cpu_2.data_master cpu_2.jtag_debug_module avalon
set_connection_parameter_value cpu_2.data_master/cpu_2.jtag_debug_module baseAddress 0x08000800
add_connection cpu_2.data_master data_mem_2.s1 avalon
set_connection_parameter_value cpu_2.data_master/data_mem_2.s1 baseAddress 0x2000
add_connection cpu_2.data_master fifo_stage2_to_3.in_csr avalon
set_connection_parameter_value cpu_2.data_master/fifo_stage2_to_3.in_csr baseAddress 0x08001000
add_connection cpu_2.data_master fifo_stage2_to_3.out avalon
set_connection_parameter_value cpu_2.data_master/fifo_stage2_to_3.out baseAddress 0x0800106c
add_connection cpu_2.data_master fifo_stage3_to_4.in avalon
set_connection_parameter_value cpu_2.data_master/fifo_stage3_to_4.in baseAddress 0x08001068
add_connection cpu_2.data_master fifo_stage3_to_4.in_csr avalon
set_connection_parameter_value cpu_2.data_master/fifo_stage3_to_4.in_csr baseAddress 0x08001020
add_connection cpu_2.data_master instruction_mem_2.s1 avalon
set_connection_parameter_value cpu_2.data_master/instruction_mem_2.s1 baseAddress 0x08001800
add_connection cpu_2.data_master jtag_uart_2.avalon_jtag_slave avalon
set_connection_parameter_value cpu_2.data_master/jtag_uart_2.avalon_jtag_slave baseAddress 0x08001060
add_connection cpu_2.data_master sdram_controller.s1 avalon
set_connection_parameter_value cpu_2.data_master/sdram_controller.s1 baseAddress 0x0000
add_connection cpu_2.data_master timer_2.s1 avalon
set_connection_parameter_value cpu_2.data_master/timer_2.s1 baseAddress 0x08001040
add_connection cpu_2.instruction_master cpu_2.jtag_debug_module avalon
set_connection_parameter_value cpu_2.instruction_master/cpu_2.jtag_debug_module baseAddress 0x08000800
add_connection cpu_2.instruction_master data_mem_2.s1 avalon
set_connection_parameter_value cpu_2.instruction_master/data_mem_2.s1 baseAddress 0x2000
add_connection cpu_2.instruction_master instruction_mem_2.s1 avalon
set_connection_parameter_value cpu_2.instruction_master/instruction_mem_2.s1 baseAddress 0x08001800
add_connection cpu_2.instruction_master sdram_controller.s1 avalon
set_connection_parameter_value cpu_2.instruction_master/sdram_controller.s1 baseAddress 0x0000
add_connection cpu_3.data_master cpu_3.jtag_debug_module avalon
set_connection_parameter_value cpu_3.data_master/cpu_3.jtag_debug_module baseAddress 0x08000800
add_connection cpu_3.data_master data_mem_3.s1 avalon
set_connection_parameter_value cpu_3.data_master/data_mem_3.s1 baseAddress 0x2000
add_connection cpu_3.data_master fifo_stage1_to_4.in_csr avalon
set_connection_parameter_value cpu_3.data_master/fifo_stage1_to_4.in_csr baseAddress 0x08001040
add_connection cpu_3.data_master fifo_stage1_to_4.out avalon
set_connection_parameter_value cpu_3.data_master/fifo_stage1_to_4.out baseAddress 0x08001090
add_connection cpu_3.data_master fifo_stage3_to_4.in_csr avalon
set_connection_parameter_value cpu_3.data_master/fifo_stage3_to_4.in_csr baseAddress 0x08001020
add_connection cpu_3.data_master fifo_stage3_to_4.out avalon
set_connection_parameter_value cpu_3.data_master/fifo_stage3_to_4.out baseAddress 0x0800108c
add_connection cpu_3.data_master fifo_stage4_to_5.in avalon
set_connection_parameter_value cpu_3.data_master/fifo_stage4_to_5.in baseAddress 0x08001088
add_connection cpu_3.data_master fifo_stage4_to_5.in_csr avalon
set_connection_parameter_value cpu_3.data_master/fifo_stage4_to_5.in_csr baseAddress 0x08001000
add_connection cpu_3.data_master instruction_mem_3.s1 avalon
set_connection_parameter_value cpu_3.data_master/instruction_mem_3.s1 baseAddress 0x08001800
add_connection cpu_3.data_master jtag_uart_3.avalon_jtag_slave avalon
set_connection_parameter_value cpu_3.data_master/jtag_uart_3.avalon_jtag_slave baseAddress 0x08001080
add_connection cpu_3.data_master sdram_controller.s1 avalon
set_connection_parameter_value cpu_3.data_master/sdram_controller.s1 baseAddress 0x0000
add_connection cpu_3.data_master timer_3.s1 avalon
set_connection_parameter_value cpu_3.data_master/timer_3.s1 baseAddress 0x08001060
add_connection cpu_3.instruction_master cpu_3.jtag_debug_module avalon
set_connection_parameter_value cpu_3.instruction_master/cpu_3.jtag_debug_module baseAddress 0x08000800
add_connection cpu_3.instruction_master data_mem_3.s1 avalon
set_connection_parameter_value cpu_3.instruction_master/data_mem_3.s1 baseAddress 0x2000
add_connection cpu_3.instruction_master instruction_mem_3.s1 avalon
set_connection_parameter_value cpu_3.instruction_master/instruction_mem_3.s1 baseAddress 0x08001800
add_connection cpu_3.instruction_master sdram_controller.s1 avalon
set_connection_parameter_value cpu_3.instruction_master/sdram_controller.s1 baseAddress 0x0000
add_connection cpu_4.data_master cpu_4.jtag_debug_module avalon
set_connection_parameter_value cpu_4.data_master/cpu_4.jtag_debug_module baseAddress 0x08000800
add_connection cpu_4.data_master data_mem_4.s1 avalon
set_connection_parameter_value cpu_4.data_master/data_mem_4.s1 baseAddress 0x2000
add_connection cpu_4.data_master fifo_stage1_to_5.in_csr avalon
set_connection_parameter_value cpu_4.data_master/fifo_stage1_to_5.in_csr baseAddress 0x08001020
add_connection cpu_4.data_master fifo_stage1_to_5.out avalon
set_connection_parameter_value cpu_4.data_master/fifo_stage1_to_5.out baseAddress 0x08001090
add_connection cpu_4.data_master fifo_stage4_to_5.in_csr avalon
set_connection_parameter_value cpu_4.data_master/fifo_stage4_to_5.in_csr baseAddress 0x08001000
add_connection cpu_4.data_master fifo_stage4_to_5.out avalon
set_connection_parameter_value cpu_4.data_master/fifo_stage4_to_5.out baseAddress 0x0800108c
add_connection cpu_4.data_master fifo_stage5_to_6.in avalon
set_connection_parameter_value cpu_4.data_master/fifo_stage5_to_6.in baseAddress 0x08001088
add_connection cpu_4.data_master fifo_stage5_to_6.in_csr avalon
set_connection_parameter_value cpu_4.data_master/fifo_stage5_to_6.in_csr baseAddress 0x08001040
add_connection cpu_4.data_master instruction_mem_4.s1 avalon
set_connection_parameter_value cpu_4.data_master/instruction_mem_4.s1 baseAddress 0x08001800
add_connection cpu_4.data_master jtag_uart_4.avalon_jtag_slave avalon
set_connection_parameter_value cpu_4.data_master/jtag_uart_4.avalon_jtag_slave baseAddress 0x08001080
add_connection cpu_4.data_master sdram_controller.s1 avalon
set_connection_parameter_value cpu_4.data_master/sdram_controller.s1 baseAddress 0x0000
add_connection cpu_4.data_master timer_4.s1 avalon
set_connection_parameter_value cpu_4.data_master/timer_4.s1 baseAddress 0x08001060
add_connection cpu_4.instruction_master cpu_4.jtag_debug_module avalon
set_connection_parameter_value cpu_4.instruction_master/cpu_4.jtag_debug_module baseAddress 0x08000800
add_connection cpu_4.instruction_master data_mem_4.s1 avalon
set_connection_parameter_value cpu_4.instruction_master/data_mem_4.s1 baseAddress 0x2000
add_connection cpu_4.instruction_master instruction_mem_4.s1 avalon
set_connection_parameter_value cpu_4.instruction_master/instruction_mem_4.s1 baseAddress 0x08001800
add_connection cpu_4.instruction_master sdram_controller.s1 avalon
set_connection_parameter_value cpu_4.instruction_master/sdram_controller.s1 baseAddress 0x0000
add_connection cpu_5.data_master cpu_5.jtag_debug_module avalon
set_connection_parameter_value cpu_5.data_master/cpu_5.jtag_debug_module baseAddress 0x08000800
add_connection cpu_5.data_master data_mem_5.s1 avalon
set_connection_parameter_value cpu_5.data_master/data_mem_5.s1 baseAddress 0x2000
add_connection cpu_5.data_master fifo_stage1_to_6.in_csr avalon
set_connection_parameter_value cpu_5.data_master/fifo_stage1_to_6.in_csr baseAddress 0x08001000
add_connection cpu_5.data_master fifo_stage1_to_6.out avalon
set_connection_parameter_value cpu_5.data_master/fifo_stage1_to_6.out baseAddress 0x0800106c
add_connection cpu_5.data_master fifo_stage5_to_6.in_csr avalon
set_connection_parameter_value cpu_5.data_master/fifo_stage5_to_6.in_csr baseAddress 0x08001040
add_connection cpu_5.data_master fifo_stage5_to_6.out avalon
set_connection_parameter_value cpu_5.data_master/fifo_stage5_to_6.out baseAddress 0x08001068
add_connection cpu_5.data_master instruction_mem_5.s1 avalon
set_connection_parameter_value cpu_5.data_master/instruction_mem_5.s1 baseAddress 0x08001800
add_connection cpu_5.data_master jtag_uart_5.avalon_jtag_slave avalon
set_connection_parameter_value cpu_5.data_master/jtag_uart_5.avalon_jtag_slave baseAddress 0x08001060
add_connection cpu_5.data_master sdram_controller.s1 avalon
set_connection_parameter_value cpu_5.data_master/sdram_controller.s1 baseAddress 0x0000
add_connection cpu_5.data_master timer_5.s1 avalon
set_connection_parameter_value cpu_5.data_master/timer_5.s1 baseAddress 0x08001020
add_connection cpu_5.instruction_master cpu_5.jtag_debug_module avalon
set_connection_parameter_value cpu_5.instruction_master/cpu_5.jtag_debug_module baseAddress 0x08000800
add_connection cpu_5.instruction_master data_mem_5.s1 avalon
set_connection_parameter_value cpu_5.instruction_master/data_mem_5.s1 baseAddress 0x2000
add_connection cpu_5.instruction_master instruction_mem_5.s1 avalon
set_connection_parameter_value cpu_5.instruction_master/instruction_mem_5.s1 baseAddress 0x08001800
add_connection cpu_5.instruction_master sdram_controller.s1 avalon
set_connection_parameter_value cpu_5.instruction_master/sdram_controller.s1 baseAddress 0x0000
add_connection cpu_0.d_irq jtag_uart_0.irq interrupt
set_connection_parameter_value cpu_0.d_irq/jtag_uart_0.irq irqNumber 16
add_connection cpu_0.d_irq timer_0.irq interrupt
set_connection_parameter_value cpu_0.d_irq/timer_0.irq irqNumber 1
add_connection cpu_1.d_irq jtag_uart_1.irq interrupt
set_connection_parameter_value cpu_1.d_irq/jtag_uart_1.irq irqNumber 16
add_connection cpu_1.d_irq timer_1.irq interrupt
set_connection_parameter_value cpu_1.d_irq/timer_1.irq irqNumber 1
add_connection cpu_2.d_irq jtag_uart_2.irq interrupt
set_connection_parameter_value cpu_2.d_irq/jtag_uart_2.irq irqNumber 16
add_connection cpu_2.d_irq timer_2.irq interrupt
set_connection_parameter_value cpu_2.d_irq/timer_2.irq irqNumber 1
add_connection cpu_3.d_irq jtag_uart_3.irq interrupt
set_connection_parameter_value cpu_3.d_irq/jtag_uart_3.irq irqNumber 16
add_connection cpu_3.d_irq timer_3.irq interrupt
set_connection_parameter_value cpu_3.d_irq/timer_3.irq irqNumber 1
add_connection cpu_4.d_irq jtag_uart_4.irq interrupt
set_connection_parameter_value cpu_4.d_irq/jtag_uart_4.irq irqNumber 16
add_connection cpu_4.d_irq timer_4.irq interrupt
set_connection_parameter_value cpu_4.d_irq/timer_4.irq irqNumber 1
add_connection cpu_5.d_irq jtag_uart_5.irq interrupt
set_connection_parameter_value cpu_5.d_irq/jtag_uart_5.irq irqNumber 16
add_connection cpu_5.d_irq timer_5.irq interrupt
set_connection_parameter_value cpu_5.d_irq/timer_5.irq irqNumber 1

# exported interfaces
add_interface clk clock sink
set_interface_property clk EXPORT_OF clock.clk_in
add_interface reset reset sink
set_interface_property reset EXPORT_OF clock.clk_in_reset
add_interface sdram_controller_wire conduit end
set_interface_property sdram_controller_wire EXPORT_OF sdram_controller.wire
add_interface c0 clock source
set_interface_property c0 EXPORT_OF pll.c0

save_system SoC.qsys
